# EAGLE design GSMShield v1 (EAGLE 5.11)

## Sheet 1 of 2
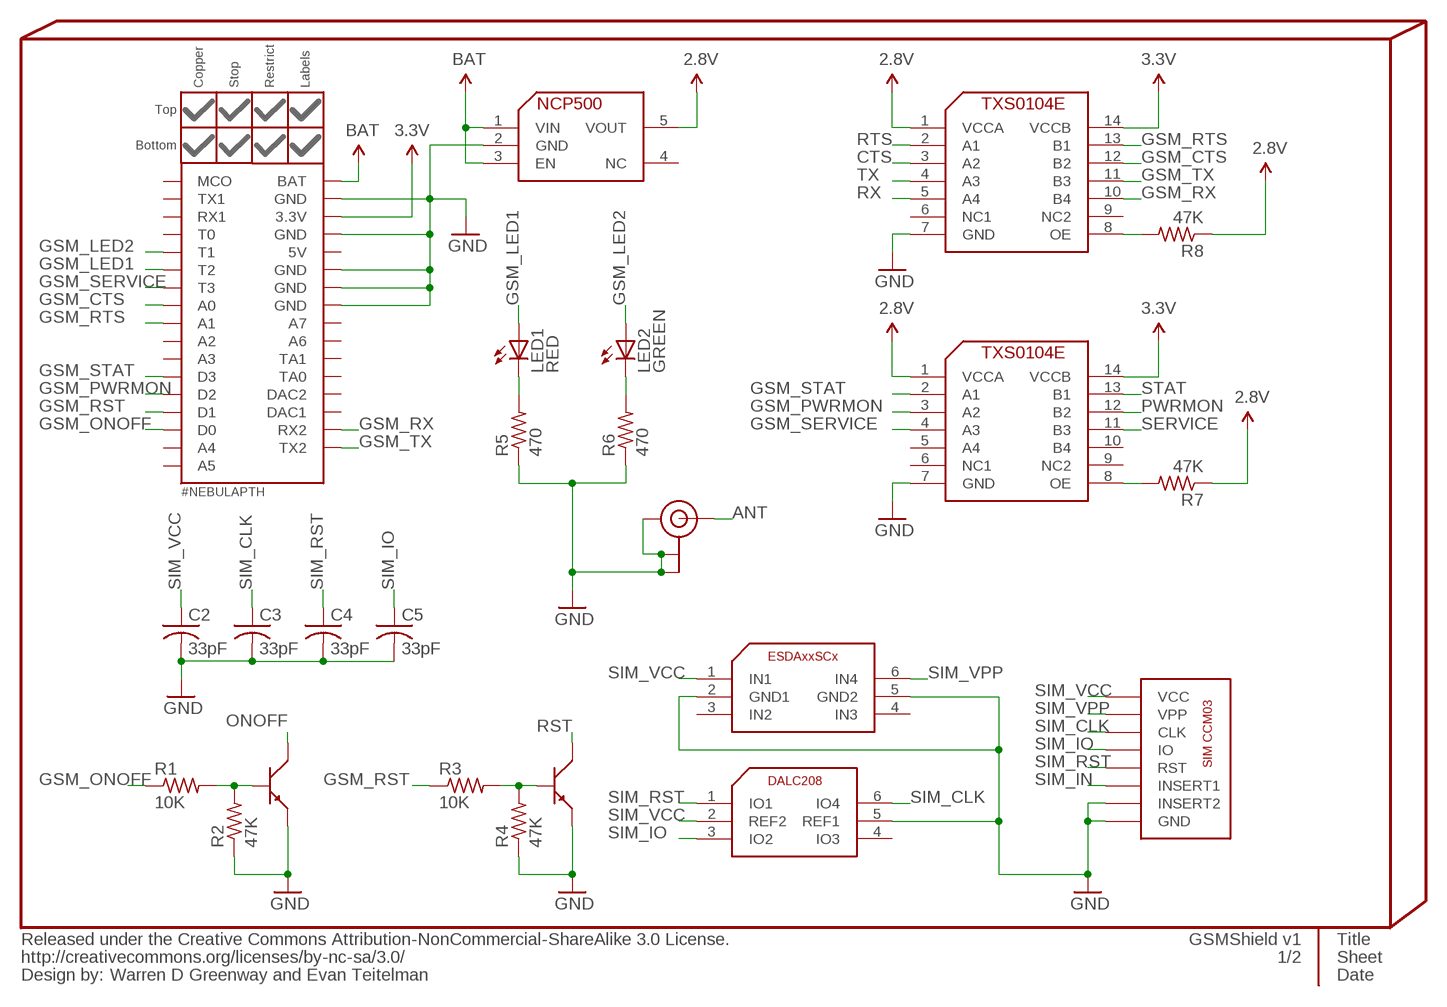
[diagram p0: schematic, sheet 1]

### Parts
C2  33pF  C-USC0402  [C0402]
C3  33pF  C-USC0402  [C0402]
C4  33pF  C-USC0402  [C0402]
C5  33pF  C-USC0402  [C0402]
INFO3  Warren D Greenway and Evan Teitelman  %CC-NC-SA  [%CC-NC-SA]
LED1  RED  LED0603  [LED-0603]
LED2  GREEN  LED0603  [LED-0603]
NEBULA1  #NEBULAPTH  [#NEBULA-PTH]
R1  10K  R-US_R0402  [R0402]
R2  47K  R-US_R0402  [R0402]
R3  10K  R-US_R0402  [R0402]
R4  47K  R-US_R0402  [R0402]
R5  470  R-US_R0402  [R0402]
R6  470  R-US_R0402  [R0402]
R7  47K  R-US_R0402  [R0402]
R8  47K  R-US_R0402  [R0402]
U2  BIPOLAR-PMBT6428  [DUBLIB_SOT23]
U3  NCP500  [SOT23-5L]
U4  ESDAXXSC6  [SOT23-6L]
U5  CCM03-3009  [CCM03-300X]
U6  BIPOLAR-PMBT6428  [DUBLIB_SOT23]
U7  DALC208  [SOT23-6L]
U8  INTERFACE-TXS0104E  [PW_R-PDSO-G14]
U9  INTERFACE-TXS0104E  [PW_R-PDSO-G14]
U$1  U.FL  [U.FL]

### Nets
2.8V: R7.1 R8.1 U3.5(VOUT) U8.1(VCCA) U9.1(VCCA) ; supply symbol labelled @2.8V
3.3V: NEBULA1.3.3V U8.14(VCCB) U9.14(VCCB) ; supply symbol labelled @3.3V
ANT: U$1.P$3(SIGNAL) ; also sheet 2
BAT: NEBULA1.BAT U3.1(VIN) U3.3(EN) ; supply symbol labelled @BAT ; also sheet 2
CTS: U9.3(A2) ; also sheet 2
GND: C2.2 C3.2 C4.2 C5.2 NEBULA1.GND1(GND) NEBULA1.GND2(GND) NEBULA1.GND3(GND) NEBULA1.GND4(GND) NEBULA1.GND5(GND) R2.1 R4.1 R5.1 R6.1 U2.2 U3.2(GND) U4.2(GND1) U4.5(GND2) U5.C5(GND) U5.P2(INSERT2) U6.2 U7.5(REF1) U8.7(GND) U9.7(GND) U$1.P$1(GND) U$1.P$2(GND) U$1.P$4(SHELL) ; supply symbol labelled @GND ; also sheet 2
GSM_CTS: NEBULA1.A0 U9.12(B2)
GSM_LED1: LED1.A NEBULA1.T2
GSM_LED2: LED2.A NEBULA1.T1
GSM_ONOFF: NEBULA1.D0 R1.1
GSM_PWRMON: NEBULA1.D2 U8.3(A2)
GSM_RST: NEBULA1.D1 R3.1
GSM_RTS: NEBULA1.A1 U9.13(B1)
GSM_RX: NEBULA1.COM2_RX(RX2) U9.10(B4)
GSM_SERVICE: NEBULA1.T3 U8.4(A3)
GSM_STAT: NEBULA1.D3 U8.2(A1)
GSM_TX: NEBULA1.COM2_TX(TX2) U9.11(B3)
N$1: R7.2 U8.8(OE)
N$2: R8.2 U9.8(OE)
N$3: R1.2 R2.2 U2.1
N$4: R3.2 R4.2 U6.1
N$9: LED1.C R5.2
N$10: LED2.C R6.2
ONOFF: U2.3 ; also sheet 2
PWRMON: U8.12(B2) ; also sheet 2
RST: U6.3 ; also sheet 2
RTS: U9.2(A1) ; also sheet 2
RX: U9.5(A4) ; also sheet 2
SERVICE: U8.11(B3) ; also sheet 2
SIM_CLK: C3.1 U5.C3(CLK) U7.6(IO4) ; also sheet 2
SIM_IN: U5.P1(INSERT1) ; also sheet 2
SIM_IO: C5.1 U5.C7(IO) U7.3(IO2) ; also sheet 2
SIM_RST: C4.1 U5.C2(RST) U7.1(IO1) ; also sheet 2
SIM_VCC: C2.1 U4.1(IN1) U5.C1(VCC) U7.2(REF2) ; also sheet 2
SIM_VPP: U4.6(IN4) U5.C6(VPP)
STAT: U8.13(B1) ; also sheet 2
TX: U9.4(A3) ; also sheet 2
Unconnected: NEBULA1.5V NEBULA1.A2 NEBULA1.A3 NEBULA1.A4 NEBULA1.A5 NEBULA1.A6 NEBULA1.A7 NEBULA1.COM1_RX(RX1) NEBULA1.COM1_TX(TX1) NEBULA1.DAC1 NEBULA1.DAC2 NEBULA1.MCO NEBULA1.T0 NEBULA1.TA0 NEBULA1.TA1 U3.4(NC) U4.3(IN2) U4.4(IN3) U7.4(IO3) U8.5(A4) U8.6(NC1) U8.9(NC2) U8.10(B4) U9.6(NC1) U9.9(NC2)

## Sheet 2 of 2
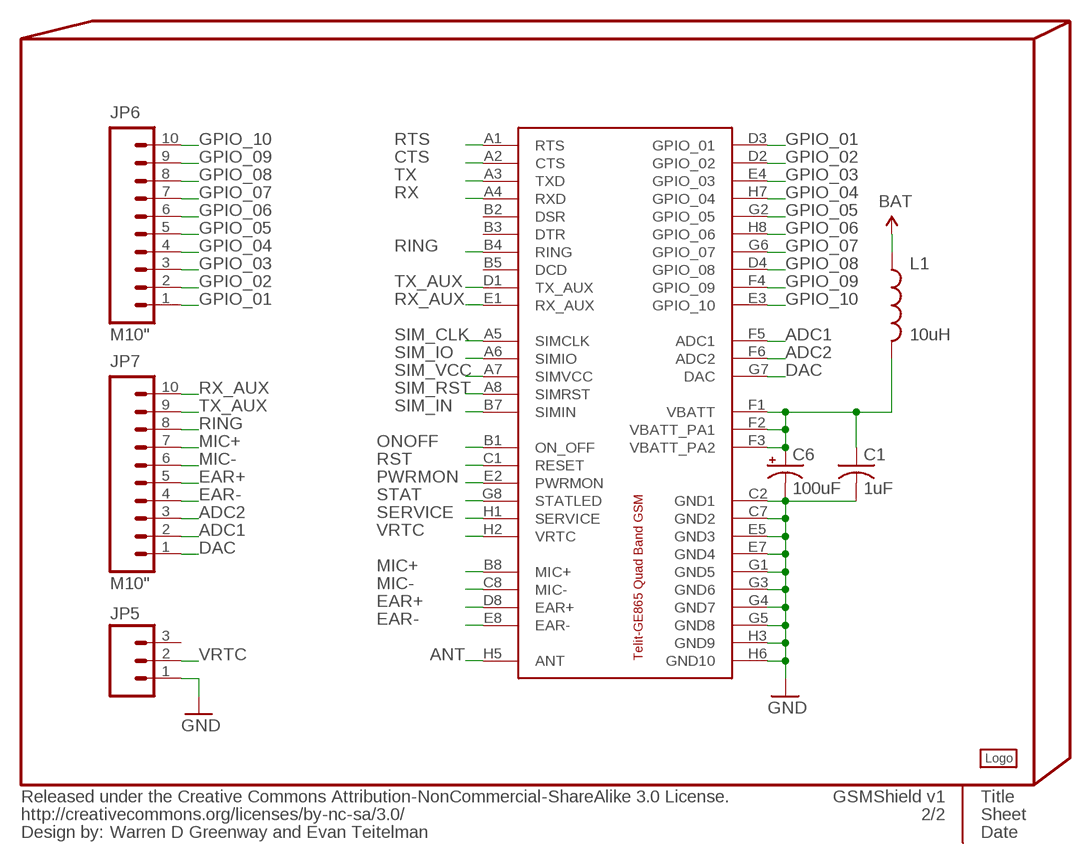
[diagram p1: schematic, sheet 2]

### Parts
C1  1uF  C-USC0402  [C0402]
C6  100uF  CAP_POL6032  [EIA6032]
JP5  M03PTH  [1X03]
JP6  M10"  [1X10]
JP7  M10"  [1X10]
L1  10uH  INDUCTOR1210  [1210]
LOGO2  #PYGMYLOGOLARGE  [#PYGMYLOGO]
U11  TELIT-GE865T  [TELIT-GE865]

### Nets
ADC1: JP7.2 U11.F5(ADC1)
ADC2: JP7.3 U11.F6(ADC2)
ANT: U11.H5(ANT) ; also sheet 1
BAT: L1.1 ; supply symbol labelled @BAT ; also sheet 1
CTS: U11.A2(CTS) ; also sheet 1
DAC: JP7.1 U11.G7(DAC)
EAR+: JP7.5 U11.D8(EAR+)
EAR-: JP7.4 U11.E8(EAR-)
GND: C1.2 C6.P$2(-) JP5.1 U11.C2(GND1) U11.C7(GND2) U11.E5(GND3) U11.E7(GND4) U11.G1(GND5) U11.G3(GND6) U11.G4(GND7) U11.G5(GND8) U11.H3(GND9) U11.H6(GND10) ; supply symbol labelled @GND ; also sheet 1
GPIO_01: JP6.1 U11.D3(GPIO_01)
GPIO_02: JP6.2 U11.D2(GPIO_02)
GPIO_03: JP6.3 U11.E4(GPIO_03)
GPIO_04: JP6.4 U11.H7(GPIO_04)
GPIO_05: JP6.5 U11.G2(GPIO_05)
GPIO_06: JP6.6 U11.H8(GPIO_06)
GPIO_07: JP6.7 U11.G6(GPIO_07)
GPIO_08: JP6.8 U11.D4(GPIO_08)
GPIO_09: JP6.9 U11.F4(GPIO_09)
GPIO_10: JP6.10 U11.E3(GPIO_10)
MIC+: JP7.7 U11.B8(MIC+)
MIC-: JP7.6 U11.C8(MIC-)
N$5: C1.1 C6.P$1(+) L1.2 U11.F1(VBATT) U11.F2(VBATT_PA1) U11.F3(VBATT_PA2)
ONOFF: U11.B1(ON_OFF) ; also sheet 1
PWRMON: U11.E2(PWRMON) ; also sheet 1
RING: JP7.8 U11.B4(RING)
RST: U11.C1(RESET) ; also sheet 1
RTS: U11.A1(RTS) ; also sheet 1
RX: U11.A4(RXD) ; also sheet 1
RX_AUX: JP7.10 U11.E1(RX_AUX)
SERVICE: U11.H1(SERVICE) ; also sheet 1
SIM_CLK: U11.A5(SIMCLK) ; also sheet 1
SIM_IN: U11.B7(SIMIN) ; also sheet 1
SIM_IO: U11.A6(SIMIO) ; also sheet 1
SIM_RST: U11.A8(SIMRST) ; also sheet 1
SIM_VCC: U11.A7(SIMVCC) ; also sheet 1
STAT: U11.G8(STATLED) ; also sheet 1
TX: U11.A3(TXD) ; also sheet 1
TX_AUX: JP7.9 U11.D1(TX_AUX)
VRTC: JP5.2 U11.H2(VRTC)
Unconnected: JP5.3 U11.B2(DSR) U11.B3(DTR) U11.B5(DCD)

## Library data of the parts
C1-C5 = rcl:C-US: CAPACITOR, American symbol
C6 = SparkFun:CAP_POL: Capacitor Polarized These are standard SMD and PTH capacitors. Normally 10uF, 47uF, and 100uF in electrolytic and tantalum varieties. Always verify the external diameter of the through hole cap, it varies with capacity, voltage, and manufacturer. The EIA devices should be standard.
INFO3 = PygmyBoards:%CC-NC-SA: Released under the Creative Commons Attribution-NonCommercial-ShareAlike 3.0 License. http://creativecommons.org/licenses/by-sa/3.0 Design by: [Designer Name] Change this part's value to change the designer name
JP5 = SparkFun:M03: Header 3 Standard 3-pin 0.1" header. Use with straight break away headers (SKU : PRT-00116), right angle break away headers (PRT-00553), swiss pins (PRT-00743), machine pins (PRT-00117), and female headers (PRT-00115). Molex polarized connector foot print use with SKU : PRT-08232 with associated crimp pins and housings.
JP6 JP7 = SparkFun:M10: Header 10 Standard 10-pin 0.1" header. Use with straight break away headers (SKU : PRT-00116), right angle break away headers (PRT-00553), swiss pins (PRT-00743), machine pins (PRT-00117), and female headers (PRT-00115).
L1 = Pygmy:INDUCTOR: Inductors Basic Inductor/Choke - 0603 and 1206. Footprints are not proven and vary greatly between part numbers.
LED1 LED2 = SparkFun:LED: LEDs Standard schematic elements and footprints for 5mm, 3mm, 1206, and 0603 sized LEDs. 5mm - Spark Fun Electronics SKU : COM-00529 (and others)
LOGO2 = Pygmy:#PYGMYLOGO
NEBULA1 = PygmyBoards:#NEBULA: Nebula Board and Shield Footprint Pads This is the only absolutely required part for the footprint. The parts in "#NEBULA-PART" are merely aesthetic. A circular board outline should be .001" thick and 1.005" in diameter (Reference circle on the Document (48) layer provided).
R1-R8 = rcl:R-US_: RESISTOR, American symbol
U2 U6 = Pygmy:BIPOLAR-PMBT6428
U3 = Pygmy:NCP500
U4 = Pygmy:ESDAXXSC6
U5 = Pygmy:CCM03-3009
U7 = Pygmy:DALC208
U8 U9 = Pygmy:INTERFACE-TXS0104E
U11 = Pygmy:TELIT-GE865
U$1 = Pygmy:U.FL

## Board
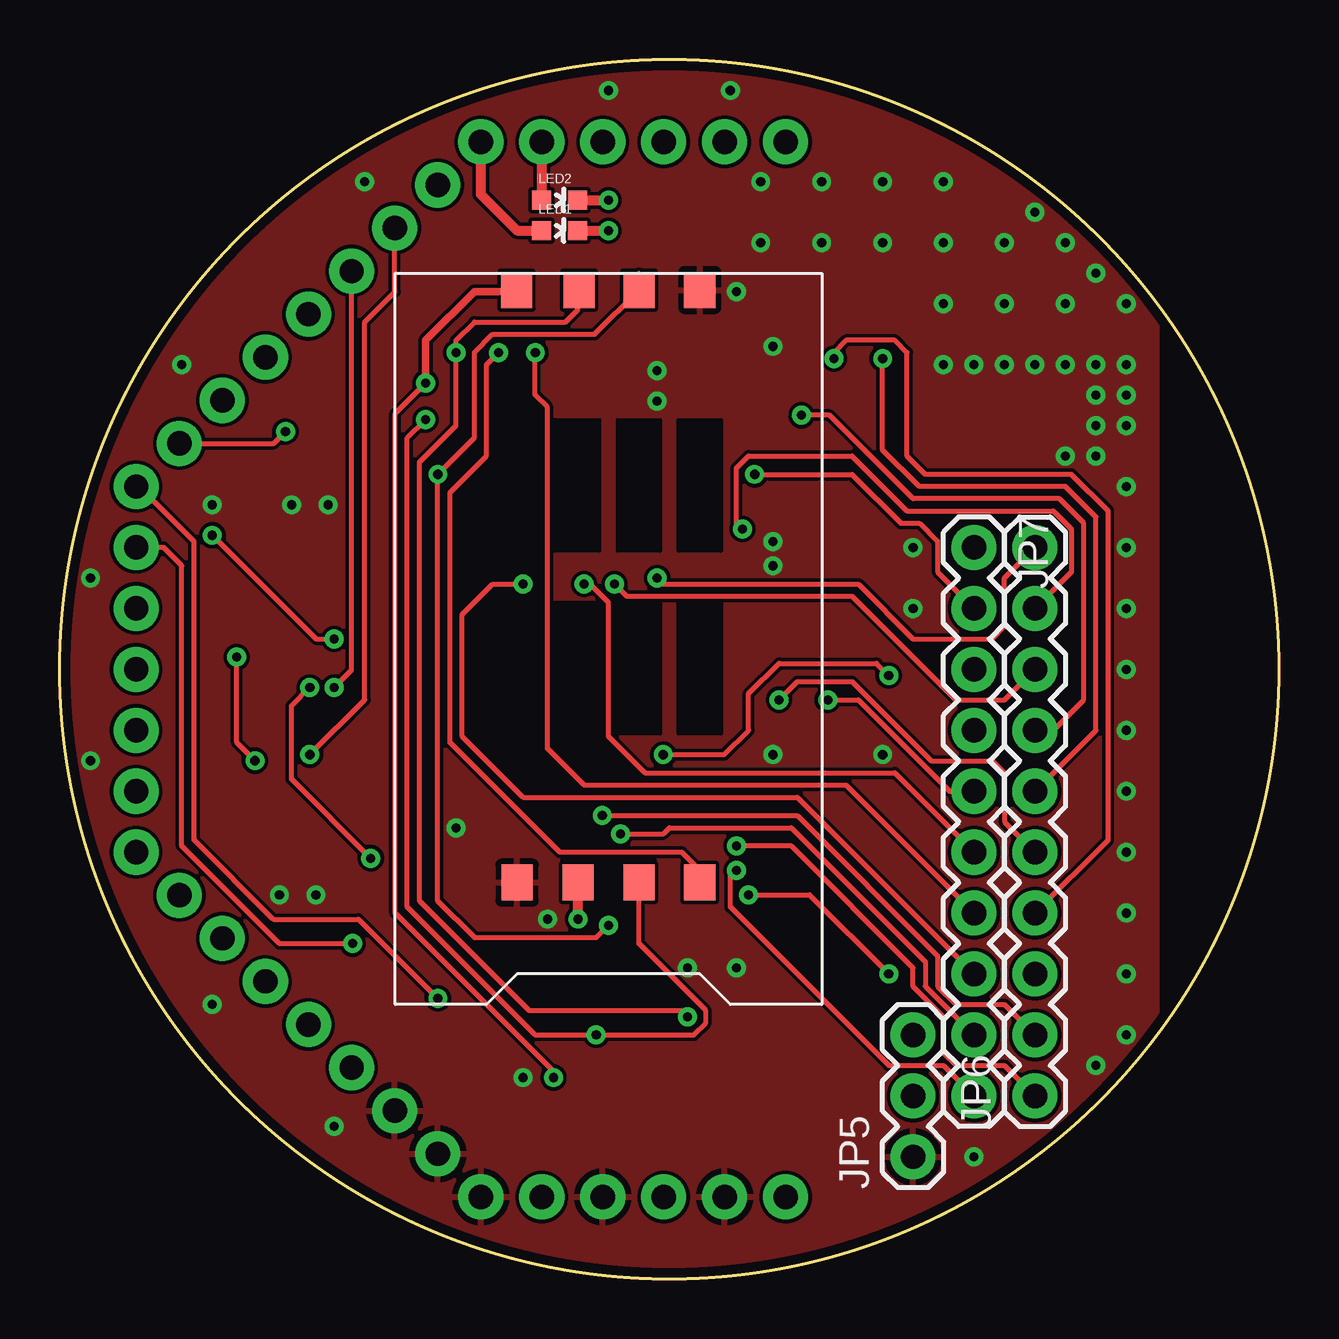
[diagram p2: board, top side]
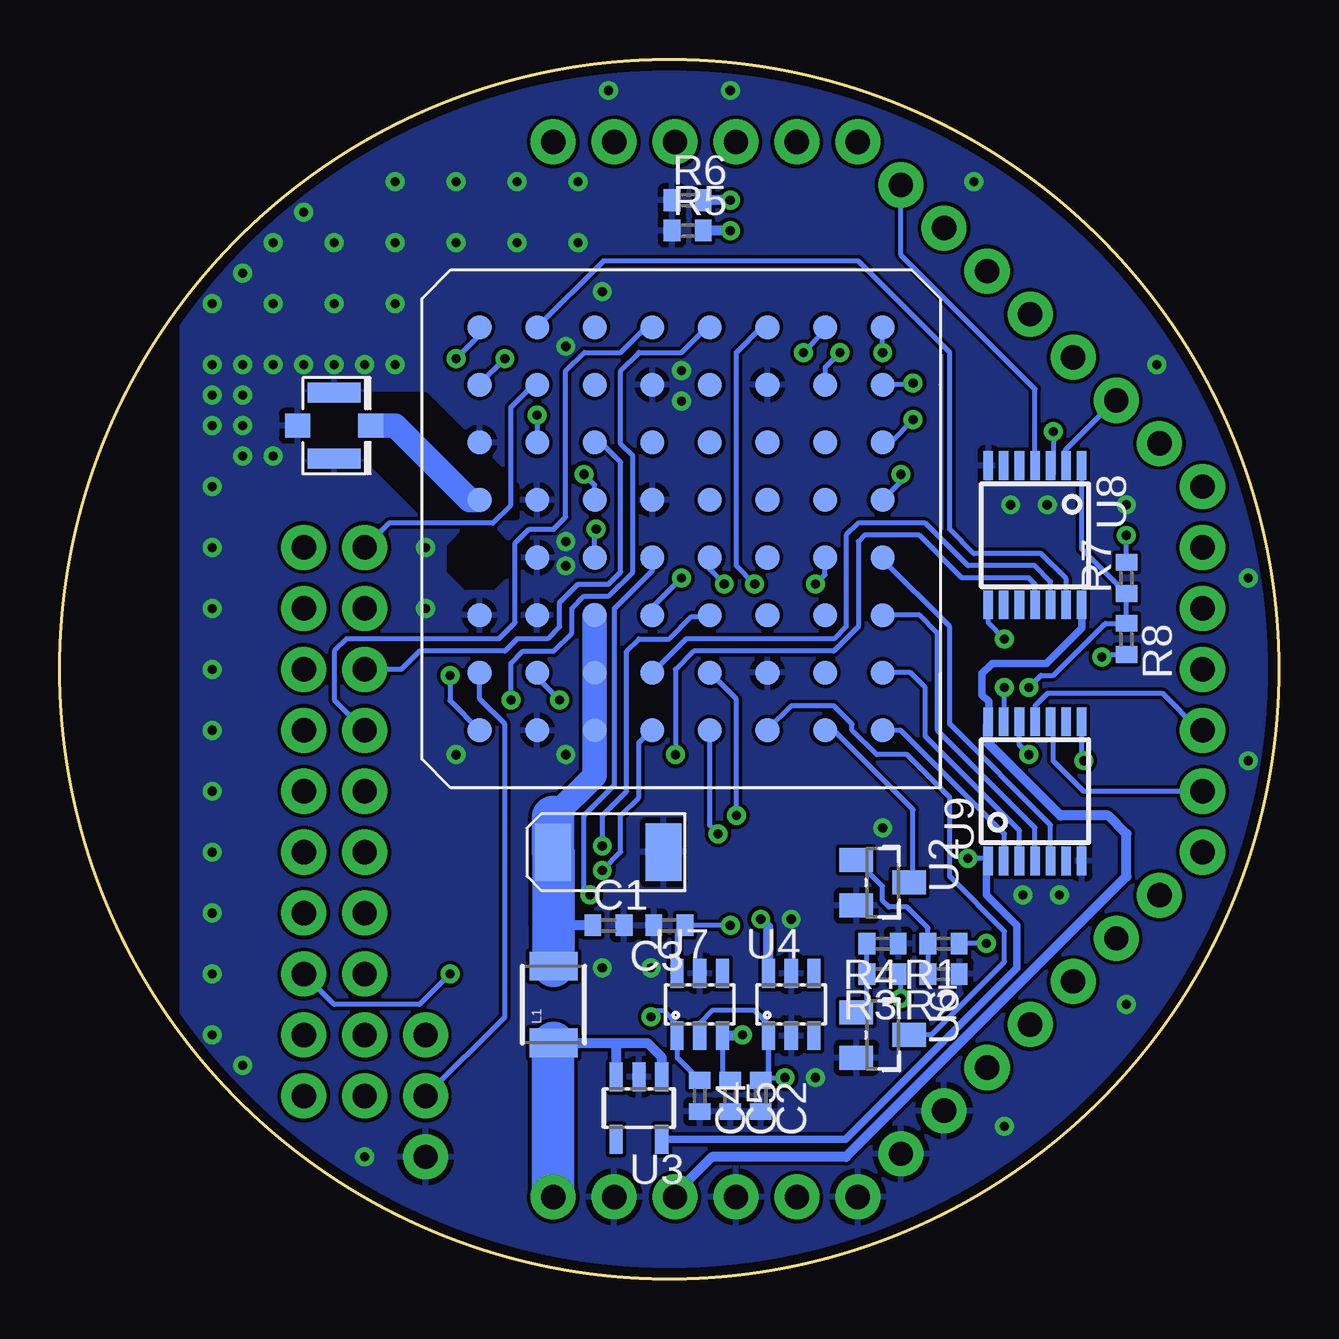
[diagram p3: board, bottom side, seen from below]

Size 50.8 x 50.8 mm. Coordinates in mm from the lower left corner, seen from the top.
Outline: circle at 25.4,25.4 radius 25.4
Copper layers (1*16): Top 0.035mm / dielectric 1.5mm / Bottom 0.035mm
Design rules "PDX (Production)": minimum track width 6mil, minimum drill 15mil, track to track 6mil, track to pad 6mil, pad to pad 4mil, via to via 6mil, smd to smd 4mil, copper to edge 15mil, drill to drill 6mil, minimum pad ring 10mil, minimum via ring 8mil, stop-mask expansion 4mil, vias tented up to drill 25mil, thermal gap 10mil
bRestrict: area 31.7,31.7 to 40.6,36.8

### Footprints (pad centres in the part's own frame; a part is rotated, then mirrored left to right if it is on the bottom)
C0402 = smd 0.7 x 0.9: 1 -0.65,0; 2 0.65,0
EIA6032 = smd 1.5 x 2.4: P$1 -2.3,0; P$2 2.3,0
1X03 = drill 1.016 pad 1.88 round: 1 0,0; 2 2.54,0; 3 5.08,0
1X10 = drill 1.016 pad 1.88 round: 1 0,0; 2 2.54,0; 3 5.08,0; 4 7.62,0; 5 10.16,0; 6 12.7,0; 7 15.24,0; 8 17.78,0; 9 20.32,0; 10 22.86,0
1210 = smd 1.2 x 2: 1 -1.6,0; 2 1.6,0
LED-0603 = smd 0.8 x 0.8: A 0,-0.75; C 0,0.75
#NEBULA-PTH@1 = drill 1.016 pad 1.88 round: 3.3V -25.637,-47.388; 5V -30.716,-47.388; A0 -36.848,-7.004; A1 -38.645,-8.8; A2 -40.44,-10.596; A3 -42.237,-12.392; A4 -47.625,-22.86; A5 -47.625,-25.4; A6 -40.44,-40.204; A7 -38.645,-42; BAT -20.557,-47.388; COM1_RX -25.636,-3.412; COM1_TX -23.096,-3.412; COM2_RX -47.625,-30.48; COM2_TX -47.625,-27.94; D0 -47.625,-20.32; D1 -47.625,-17.78; D2 -45.829,-15.984; D3 -44.032,-14.188; DAC1 -47.625,-33.02; DAC2 -45.829,-34.816; GND1 -36.848,-43.796; GND2 -35.052,-45.592; GND3 -33.256,-47.388; GND4 -28.177,-47.388; GND5 -23.097,-47.388; MCO -20.556,-3.412; T0 -28.176,-3.412; T1 -30.716,-3.412; T2 -33.256,-3.412; T3 -35.052,-5.208; TA0 -44.032,-36.612; TA1 -42.237,-38.408
R0402 = smd 0.7 x 0.9: 1 -0.65,0; 2 0.65,0
DUBLIB_SOT23 = smd 1 x 1.4: 1 -0.95,-1.1; 2 0.95,-1.1; 3 0,1.1
SOT23-5L = smd 0.55 x 1.2: 1 -0.95,-1.3; 2 0,-1.3; 3 0.95,-1.3; 4 0.95,1.3; 5 -0.95,1.3
SOT23-6L = smd 0.55 x 1.2: 1 -0.95,-1.3; 2 0,-1.3; 3 0.95,-1.3; 4 0.95,1.3; 5 0,1.3; 6 -0.95,1.3
CCM03-300X = smd 1.5 x 1.3: C1 24.7,5.1; C2 24.7,2.5; C3 24.7,0; C5 0,5.08; C6 0,2.54; C7 0,0; P1 0,-2.54; P2 24.705,-2.54
PW_R-PDSO-G14 = smd 0.4 x 1.2: 1 -1.95,-2.9; 2 -1.3,-2.9; 3 -0.65,-2.9; 4 0,-2.9; 5 0.65,-2.9; 6 1.3,-2.9; 7 1.95,-2.9; 8 1.95,2.9; 9 1.3,2.9; 10 0.65,2.9; 11 0,2.9; 12 -0.65,2.9; 13 -1.3,2.9; 14 -1.95,2.9
TELIT-GE865 = smd 1 x 1: A1 0,0; A2 0,-2.4; A3 0,-4.8; A4 0,-7.2; A5 0,-9.6; A6 0,-12; A7 0,-14.4; A8 0,-16.8; B1 2.4,0; B2 2.4,-2.4; B3 2.4,-4.8; B4 2.4,-7.2; B5 2.4,-9.6; B6 2.4,-12; B7 2.4,-14.4; B8 2.4,-16.8; C1 4.8,0; C2 4.8,-2.4; C3 4.8,-4.8; C4 4.8,-7.2; C5 4.8,-9.6; C6 4.8,-12; C7 4.8,-14.4; C8 4.8,-16.8; D1 7.2,0; D2 7.2,-2.4; D3 7.2,-4.8; D4 7.2,-7.2; D5 7.2,-9.6; D6 7.2,-12; D7 7.2,-14.4; D8 7.2,-16.8; E1 9.6,0; E2 9.6,-2.4; E3 9.6,-4.8; E4 9.6,-7.2; E5 9.6,-9.6; E6 9.6,-12; E7 9.6,-14.4; E8 9.6,-16.8; F1 12,0; F2 12,-2.4; F3 12,-4.8; F4 12,-7.2; F5 12,-9.6; F6 12,-12; F7 12,-14.4; F8 12,-16.8; G1 14.4,0; G2 14.4,-2.4; G3 14.4,-4.8; G4 14.4,-7.2; G5 14.4,-9.6; G6 14.4,-12; G7 14.4,-14.4; G8 14.4,-16.8; H1 16.8,0; H2 16.8,-2.4; H3 16.8,-4.8; H5 16.8,-9.6; H6 16.8,-12; H7 16.8,-14.4; H8 16.8,-16.8
U.FL = smd 2.2 x 0.85: P$1 0,1.375; P$2 0,-1.375 | smd 1.05 x 1: P$3 1.525,0; P$4 -1.525,0

### Placement (x,y rotation side)
C1  27.94,14.73 0 bottom
C2  21.59,7.62 270 bottom
C3  25.4,14.73 180 bottom
C4  24.13,7.62 270 bottom
C5  22.86,7.62 270 bottom
C6  27.94,17.78 0 bottom
INFO3  -2.54,-10.16 0 top  (outside the outline)
JP5  35.56,5.08 90 top
JP6  40.64,7.62 90 top
JP7  38.1,30.48 270 top
L1  30.23,11.43 90 bottom
LED1  20.83,43.69 270 top
LED2  20.83,44.96 270 top
LOGO2  37.34,38.35 270 top
NEBULA1  #NEBULAPTH  [#NEBULA-PTH@1]  50.8,50.8 0 top
R1  13.97,13.97 180 bottom
R2  13.97,12.7 180 bottom
R3  16.51,12.7 180 bottom
R4  16.51,13.97 180 bottom
R5  24.64,43.69 0 bottom
R6  24.64,44.96 0 bottom
R7  6.35,29.21 90 bottom
R8  6.35,26.67 270 bottom
U2  16.51,16.51 270 bottom
U3  26.67,7.11 180 bottom
U4  20.32,11.43 0 bottom
U5  24.13,16.51 90 top
U6  16.51,10.16 270 bottom
U7  24.13,11.43 0 bottom
U8  10.16,30.99 180 bottom
U9  10.16,20.32 0 bottom
U11  16.51,22.86 180 bottom
U$1  39.37,35.56 0 bottom

### Tracks (layer width: path | path; a pad name or v marks a point on that pad's centre or on a via)
2.8V  (via drill 0.38)
  Top 0.203: v10.41,24.64 9.65,23.88 9.65,20.83 v12.95,17.53
  Bottom 0.203: U8.1 8.21,30.42 R7.1 R8.1 7.22,27.32 9.4,25.15 9.91,25.15 v10.41,24.64 | v12.95,17.53 12.22,17.53 U9.1
  Bottom 0.305: U3.5 18.06,5.81 10.92,12.95 10.92,14.73 12.19,16 12.19,17.34 U9.1
3.3V
  Bottom 0.203: 12.12,23.11 U9.14
  Bottom 0.305: U8.14 8.2,27.13 9.68,25.65 11.94,25.65 12.36,25.23 12.36,24.33 12.09,24.05 12.09,23.24 U9.14
  Bottom 0.406: NEBULA1.3.3V 25.16,3.54 23.62,5.08 18.03,5.08 6.35,16.76 6.35,18.54 7.11,19.3 9.09,19.3 12.12,22.33 12.12,23.11
ADC1  (via drill 0.38)
  Top 0.203: v28.96,33.53 33.02,33.53 35.05,31.5 35.81,31.5 36.58,30.73 36.58,29.46 JP7.2
  Bottom 0.203: U11.F5 28.51,33.08 v28.96,33.53
ADC2
  Bottom 0.203: U11.F6 28.26,34.86 27.43,34.04 27.43,29.46 27.94,28.96 29.21,28.96 29.97,28.19 29.97,27.18 30.48,26.67 31.75,26.67 32.26,26.16 35.81,26.16 36.58,25.4 JP7.3
ANT
  Bottom 1.016: U11.H5 33.73,32.46 36.83,35.56 U$1.P$3
BAT
  Bottom 0.406: L1.1 27.69,9.83 | 27.69,9.83 26.31,9.83 25.73,9.25 25.73,8.42 U3.1 | U3.3 27.62,9.76 27.69,9.83
  Bottom 1.778: NEBULA1.BAT 30.24,9.81 L1.1
CTS
  Bottom 0.203: U11.A2 15.35,25.26 14.73,24.64 14.73,22.61 10.81,18.68 U9.3
DAC
  Bottom 0.203: U11.G7 31.07,37.26 32,36.32 32,32.26 32.77,31.5 37.08,31.5 JP7.1
EAR+  (via drill 0.38)
  Top 0.203: v32,24.13 33.27,24.13 37.08,20.32 JP7.5
  Bottom 0.203: U11.D8 23.84,39.66 24.89,38.61 26.67,38.61 27.43,37.85 27.43,34.8 26.92,34.29 26.92,29.46 27.94,28.45 28.96,28.45 29.46,27.94 29.46,26.92 30.23,26.16 31.5,26.16 32,25.65 v32,24.13
EAR-
  Bottom 0.203: U11.E8 26.38,39.66 27.43,38.61 28.96,38.61 29.72,37.85 29.72,31.75 30.23,31.24 31.24,31.24 31.83,30.66 31.83,27.36 32.51,26.67 38.86,26.67 39.37,26.16 39.37,24.13 JP7.4
GND  (via drill 0.38)
  other vias: 1.27,29.21 44.45,30.48 27.94,49.53 34.29,45.72 36.83,40.64 12.7,45.72 44.45,15.24 41.91,38.1 44.45,40.64 38.1,5.08 44.45,25.4 41.91,43.18 40.64,38.1 44.45,12.7 31.75,43.18 29.21,43.18 22.86,49.53 44.45,36.83 35.56,30.48 44.45,38.1 5.08,38.1 41.91,40.64 43.18,38.1 41.91,34.29 44.45,35.56 43.18,34.29 44.45,33.02 44.45,27.94 44.45,20.32 44.45,17.78 44.45,10.16 36.83,45.72 43.18,41.91 6.35,11.43 39.37,40.64 43.18,8.89 43.18,35.56 29.21,45.72 39.37,43.18 1.27,21.59 36.83,43.18 40.64,44.45 31.75,45.72 43.18,36.83 38.1,38.1 36.83,38.1 44.45,22.86 11.43,6.35 39.37,38.1 35.56,27.94 34.29,43.18 16.51,18.8 20.32,14.99 6.35,32.26 9.65,32.26 11.18,32.26 19.3,8.38 26.16,12.95 28.19,12.95 9.14,16 10.67,16 24.89,36.58 28.19,41.15 29.72,21.84 34.29,21.84 29.72,30.73 24.89,37.85 29.72,38.86 29.72,29.72
  pour Bottom: -2.54,53.34 45.72,53.34 45.72,-2.54 -2.54,-2.54
  pour Top: -1.27,52.07 45.72,52.07 45.72,-1.27 -1.27,-1.27
GPIO_01  (via drill 0.38)
  Top 0.203: v28.19,18.03 30.48,18.03 35.56,12.95 35.56,12.19 36.83,10.92 36.83,9.4 37.34,8.89 39.37,8.89 JP6.1
  Bottom 0.203: U11.D3 23.71,27.6 24.47,27.6 25.4,26.67 26.67,26.67 27.18,26.16 27.18,20.32 28.19,19.3 v28.19,18.03
GPIO_02  (via drill 0.38)
  Top 0.203: v22.61,19.3 30.73,19.3 36.58,13.46 36.58,12.19 37.34,11.43 39.37,11.43 JP6.2
  Bottom 0.203: 23.76,25.26 U11.D2 22.61,24.16 v22.61,19.3
GPIO_03  (via drill 0.38)
  Top 0.203: v28.7,16 31.24,16 v34.54,12.7
  Bottom 0.203: U11.E4 26.11,29.52 27.69,27.94 27.69,20.57 28.96,19.3 28.96,16.26 v28.7,16 | v34.54,12.7 35.81,11.43 39.37,11.43 JP6.3
GPIO_04  (via drill 0.38)
  Top 0.203: v32.26,38.35 32.26,38.61 32.77,39.12 34.8,39.12 35.31,38.61 35.31,34.29 36.07,33.53 42.16,33.53 43.69,32 43.69,18.29 JP6.4
  Bottom 0.203: U11.H7 33.31,37.3 v32.26,38.35
GPIO_05  (via drill 0.38)
  Top 0.203: v29.97,24.13 30.73,24.89 33.02,24.89 36.32,21.59 38.86,21.59 39.37,21.08 39.37,19.05 JP6.5
  Bottom 0.203: U11.G2 30.91,25.07 v29.97,24.13
GPIO_06  (via drill 0.38)
  Top 0.203: v34.29,38.35 34.29,34.54 35.81,33.02 41.91,33.02 43.18,31.75 43.18,22.86 JP6.6
  Bottom 0.203: U11.H8 33.31,39.33 v34.29,38.35
GPIO_07  (via drill 0.38)
  Top 0.203: JP6.7 41.4,22.86 42.67,24.13 42.67,31.5 41.66,32.51 35.56,32.51 32.08,35.99 v30.91,35.99
  Bottom 0.203: U11.G6 v30.91,35.99
GPIO_08  (via drill 0.38)
  Top 0.203: v23.11,28.96 23.62,28.45 33.02,28.45 37.34,24.13 39.37,24.13 JP6.8
  Bottom 0.203: U11.D4 23.71,29.55 v23.11,28.96
GPIO_09  (via drill 0.38)
  Top 0.203: v28.45,31.24 28.19,31.5 28.19,33.78 28.7,34.29 33.02,34.29 35.31,32 41.4,32 42.16,31.24 42.16,29.46 JP6.9
  Bottom 0.203: U11.F4 28.51,31.18 v28.45,31.24
GPIO_10  (via drill 0.38)
  Top 0.203: v24.89,29.21 25.15,28.96 33.27,28.96 35.56,26.67 38.86,26.67 39.37,27.18 39.37,29.21 JP6.10
  Bottom 0.203: U11.E3 26.11,27.99 v24.89,29.21
GSM_CTS  (via drill 0.38)
  Top 0.203: NEBULA1.A0 13.95,41.13 12.7,39.88 12.7,24.13 v10.41,21.84
  Bottom 0.203: U9.12 10.81,22.24 v10.41,21.84
GSM_LED1
  Top 0.406: NEBULA1.T2 17.54,45.19 19.05,43.69 LED1.A
GSM_LED2
  Top 0.406: NEBULA1.T1 LED2.A
GSM_ONOFF  (via drill 0.38)
  Top 0.203: NEBULA1.D0 4.32,30.48 5.08,29.72 5.08,18.03 9.14,13.97 v12.19,13.97
  Bottom 0.203: v12.19,13.97 R1.1
GSM_PWRMON  (via drill 0.38)
  Top 0.203: NEBULA1.D2 8.91,34.82 v9.4,35.31
  Bottom 0.203: v9.4,35.31 9.4,33.78 | 9.4,33.78 9.4,33.49 | U8.3 9.4,33.78
GSM_RST  (via drill 0.38)
  Top 0.203: NEBULA1.D1 3.3,33.02 5.59,30.73 5.59,18.29 8.89,14.99 12.45,14.99 v15.75,11.68
  Bottom 0.203: v15.75,11.68 15.75,12.59 R3.1
GSM_RTS  (via drill 0.38)
  Top 0.203: NEBULA1.A1 12.15,25.36 v11.43,24.64
  Bottom 0.203: v11.43,24.64 11.43,23.25 U9.13
GSM_RX
  Bottom 0.203: NEBULA1.COM2_RX 8.13,20.32 9.4,21.59 9.4,23.11 U9.10
GSM_SERVICE
  Bottom 0.203: NEBULA1.T3 15.75,42.67 10.16,37.08 U8.4
GSM_STAT
  Bottom 0.203: NEBULA1.D3 6.82,36.61 8.89,34.54 8.89,33.92 U8.2
GSM_TX
  Bottom 0.203: NEBULA1.COM2_TX 3.3,22.86 4.83,24.38 9.65,24.38 10.16,23.88 U9.11
MIC+  (via drill 0.38)
  Top 0.203: v19.81,38.61 19.81,36.83 20.32,36.32 20.32,22.1 21.84,20.57 32.77,20.57 JP7.7
  Bottom 0.203: U11.B8 18.91,39.51 v19.81,38.61
MIC-  (via drill 0.38)
  Top 0.203: v21.84,28.96 22.1,28.96 22.86,28.19 22.86,22.61 24.38,21.08 34.8,21.08 JP7.6
  Bottom 0.203: U11.C8 21.55,39.66 22.61,38.61 22.61,29.72 v21.84,28.96
N$1  (via drill 0.38)
  Top 0.203: v6.35,30.99 10.67,26.67 v11.43,26.67
  Bottom 0.203: U8.8 12.11,27.35 v11.43,26.67 | R7.2 v6.35,30.99
N$2  (via drill 0.38)
  Top 0.203: v7.37,25.91 7.37,22.35 v8.13,21.59
  Bottom 0.203: R8.2 7.25,26.02 v7.37,25.91 | v8.13,21.59 8.2,21.67 U9.8
N$3
  Bottom 0.203: U2.1 16.51,16.36 16.51,15.75 16.26,15.49 15.49,15.49 14.62,14.62 R1.2 R2.2
N$4
  Bottom 0.203: R4.2 R3.2 17.16,11.56 U6.1
N$5
  Bottom 0.406: C1.1 30.23,14.73
  Bottom 1.016: 30.24,19.24 28.52,20.95 28.52,22.85 U11.F1 U11.F2 U11.F3
  Bottom 1.778: L1.2 30.23,14.73 30.23,17.77 C6.P$1 30.24,19.24
N$9  (via drill 0.38)
  Top 0.406: LED1.C v22.86,43.69
  Bottom 0.406: v22.86,43.69 R5.2
N$10  (via drill 0.38)
  Top 0.406: LED2.C v22.86,44.96
  Bottom 0.406: v22.86,44.96 R6.2
ONOFF
  Bottom 0.203: U11.B1 18.54,22.86 15.24,19.56 15.24,16.68 U2.3 15.35,16.57
PWRMON
  Bottom 0.203: U8.12 9.51,29.07 10.16,29.72 12.95,29.72 14.73,31.5 17.53,31.5 18.03,30.99 18.03,27.18 18.54,26.67 24.7,26.67 U11.E2
RING  (via drill 0.38)
  Top 0.203: v19.3,28.96 18.03,28.96 16.76,27.69 16.76,22.61 19.3,20.07 30.73,20.07 JP7.8
  Bottom 0.203: U11.B4 18.91,29.35 v19.3,28.96
RST
  Bottom 0.203: U11.C1 21.31,22.89 20.32,23.88 18.54,23.88 17.78,23.11 17.78,22.86 16.76,21.84 15.49,21.84 13.72,20.07 13.72,16.76 11.43,14.48 11.43,13.21 14.48,10.16 U6.3
RTS
  Bottom 0.203: U11.A1 15.75,22.86 11.43,18.54 11.43,17.45 U9.2
RX
  Bottom 0.203: U11.A4 16.51,29.97 13.72,27.18 13.72,23.11 9.51,18.91 U9.5
RX_AUX  (via drill 0.38)
  Top 0.203: JP7.10 36.83,8.89 34.54,8.89 27.94,15.49 27.94,16.76 v28.19,17.02
  Bottom 0.203: U11.E1 26.16,22.86 26.67,22.35 26.67,20.07 27.43,19.3 27.43,17.78 v28.19,17.02
SERVICE  (via drill 0.38)
  Top 0.203: v34.54,25.15 34.04,25.65 29.97,25.65 28.7,24.38 28.7,22.86 27.69,21.84 v25.15,21.84
  Bottom 0.203: U8.11 10.16,28.96 10.41,29.21 13.21,29.21 14.99,30.99 17.27,30.99 17.53,30.73 17.53,27.18 18.54,26.16 24.38,26.16 25.15,25.4 v25.15,21.84 | v34.54,25.15 34.54,24.09 U11.H1
SIM_CLK  (via drill 0.38)
  Top 0.203: 24.13,41.91 U5.C3 22.29,39.37 18.03,39.37 17.27,38.61 17.27,35.05 v15.75,33.53 15.75,15.75 17.27,14.22 22.35,14.22 v22.86,14.73
  Bottom 0.203: U7.6 25.08,14.4 C3.1 v22.86,14.73 | v15.75,33.53 15.75,33.22 U11.A5
SIM_IN  (via drill 0.38)
  Top 0.203: v18.29,38.61 17.78,38.1 17.78,34.29 16.26,32.77 16.26,22.35 20.83,17.78 25.91,17.78 26.67,17.02 U5.P1
  Bottom 0.203: U11.B7 18.91,37.99 v18.29,38.61
SIM_IO  (via drill 0.38)
  Top 0.203: v15.24,35.81 14.48,35.05 14.48,15.49 19.81,10.16 v22.35,10.16 26.42,10.16 26.92,10.67 26.92,11.18 24.13,13.97 U5.C7
  Bottom 0.203: U7.3 23.18,8.59 C5.1 | U11.A6 16.19,34.86 v15.24,35.81
  Bottom 0.406: U7.3 22.38,10.13 v22.35,10.16
SIM_RST  (via drill 0.38)
  Top 0.203: U5.C2 21.59,41.17 21.59,40.39 21.08,39.88 17.27,39.88 16.51,39.12 v16.51,38.61 16.51,35.56 14.99,34.04 14.99,15.75 19.56,11.18 25.91,11.18 v26.16,10.92
  Bottom 0.203: C4.1 25.08,9.22 U7.1 25.08,10.6 25.65,11.18 25.91,11.18 v26.16,10.92 | v16.51,38.61 U11.A8
SIM_VCC  (via drill 0.38)
  Top 0.203: v20.57,8.38 20.57,8.64 13.97,15.24 13.97,36.07 v15.24,37.34
  Top 0.305: v15.24,37.34 15.24,39.12 17.27,41.15 18.97,41.15 U5.C1
  Bottom 0.203: U4.1 21.27,8.59 C2.1 | U11.A7 15.32,37.26 v15.24,37.34 | U4.1 21.27,8.45 21.34,8.38 v20.57,8.38 | U7.2 24.13,10.67 23.62,11.18 21.84,11.18 21.34,10.67 21.34,10.2 U4.1
SIM_VPP  (via drill 0.38)
  Top 0.406: v21.59,14.99 U5.C6
  Bottom 0.406: U4.6 21.27,14.67 v21.59,14.99
STAT
  Bottom 0.203: U8.13 8.86,29.18 9.91,30.23 12.7,30.23 13.72,31.24 13.72,38.61 17.53,42.42 28.15,42.42 U11.G8
TX
  Bottom 0.203: U11.A3 14.96,27.66 14.22,26.92 14.22,22.86 10.16,18.8 U9.4
TX_AUX  (via drill 0.38)
  Top 0.203: v23.37,18.54 25.15,18.54 25.4,18.8 30.48,18.8 36.07,13.21 36.07,12.19 JP7.9
  Bottom 0.203: U11.D1 23.71,18.88 v23.37,18.54
VRTC
  Bottom 0.203: U11.H2 33.31,24.17 32.26,23.11 32.26,10.92 JP5.2

### Text on the board
tTest: GSM Shield v1 | Pygmy Nebula | 1
bTest: Evan Teitelman | W D Grreenway | Design By: | VBAT | GND
Document: Pygmy LCD Shield | Version 1.0 | Standard Grid: 50mil | Routing Grids: 8mil / 4mil